# EAGLE design MRCS-12v-power-block (EAGLE 7.7.0)
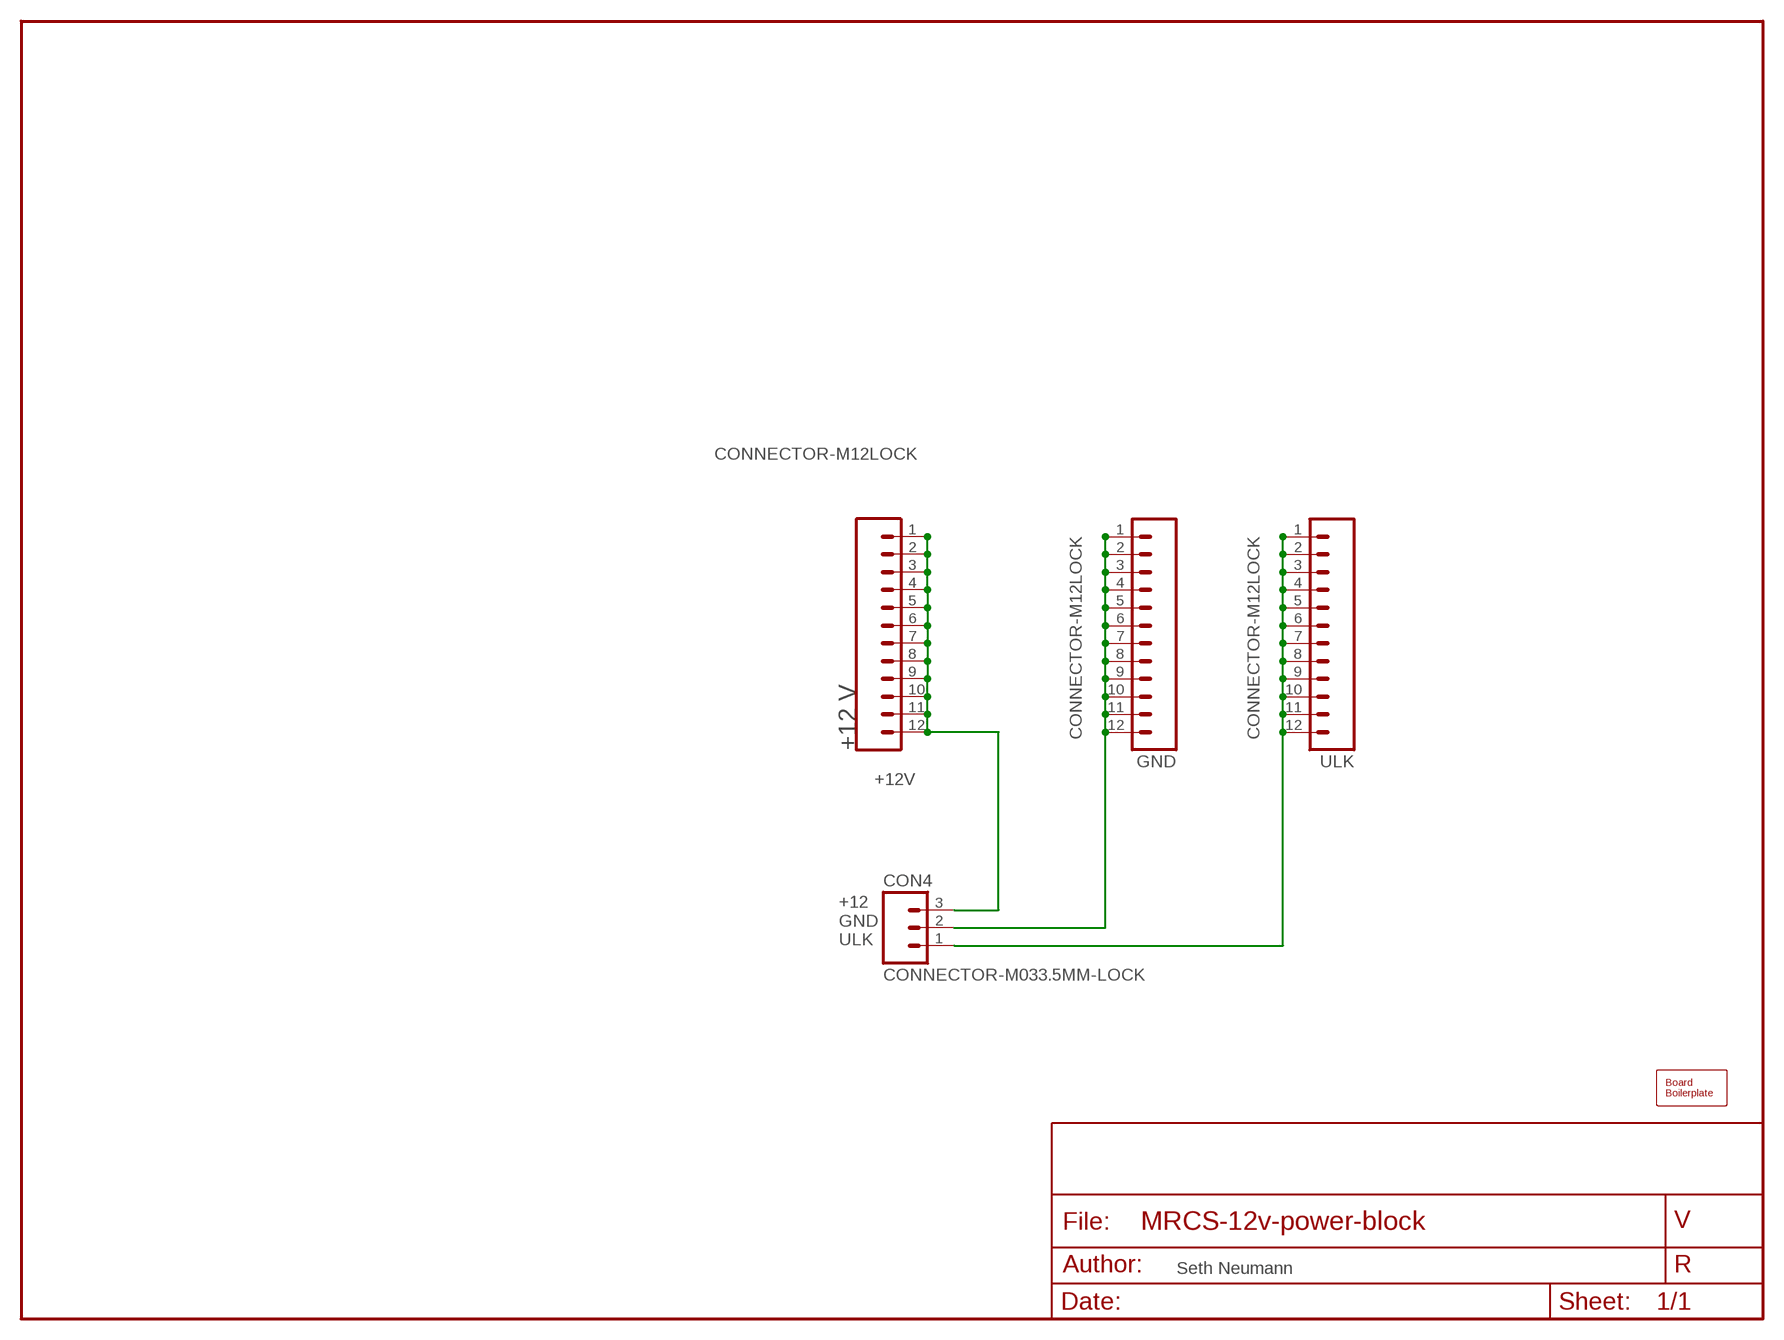
[diagram p0: schematic, sheet 1]

## Parts
+12V  CONNECTOR-M12LOCK  [1X12_LOCK]
BOARD1  BOARD50X50  [BOARD-SEEED5X5]
CON4  CONNECTOR-M033.5MM-LOCK  [SCREWTERMINAL-3.5MM-3_LOCK.007S]
GND  CONNECTOR-M12LOCK  [1X12_LOCK]
ULK  CONNECTOR-M12LOCK  [1X12_LOCK]

## Nets
N$2 [Power]: CON4.2 GND.1 GND.2 GND.3 GND.4 GND.5 GND.6 GND.7 GND.8 GND.9 GND.10 GND.11 GND.12
N$3 [Power]: CON4.1 ULK.1 ULK.2 ULK.3 ULK.4 ULK.5 ULK.6 ULK.7 ULK.8 ULK.9 ULK.10 ULK.11 ULK.12
N$4 [Power]: +12V.1 +12V.2 +12V.3 +12V.4 +12V.5 +12V.6 +12V.7 +12V.8 +12V.9 +12V.10 +12V.11 +12V.12 CON4.3

## Notes on the sheet
- +12 V
- +12
  GND
  ULK
- Seth Neumann

## Library data of the parts
+12V GND ULK = SPCoast:CONNECTOR-M12: Header 12 Standard 12-pin 0.1" header. Use with straight break away headers (SKU : PRT-00116), right angle break away headers (PRT-00553), swiss pins (PRT-00743), machine pins (PRT-00117), and female headers (PRT-00115).
BOARD1 = SPCoast:BOARD
CON4 = SPCoast:CONNECTOR-M03

## Net classes
0 default: width 0.305 mm, drill 0.127 mm, clearance 0.254 mm
1 Power: width 0.61 mm, drill 0.127 mm, clearance 0.254 mm
2 Phone: width 0.406 mm, drill 0.127 mm, clearance 0.381 mm
3 Nasty Loads: width 0.61 mm, drill 0.127 mm, clearance 0.61 mm

## Board
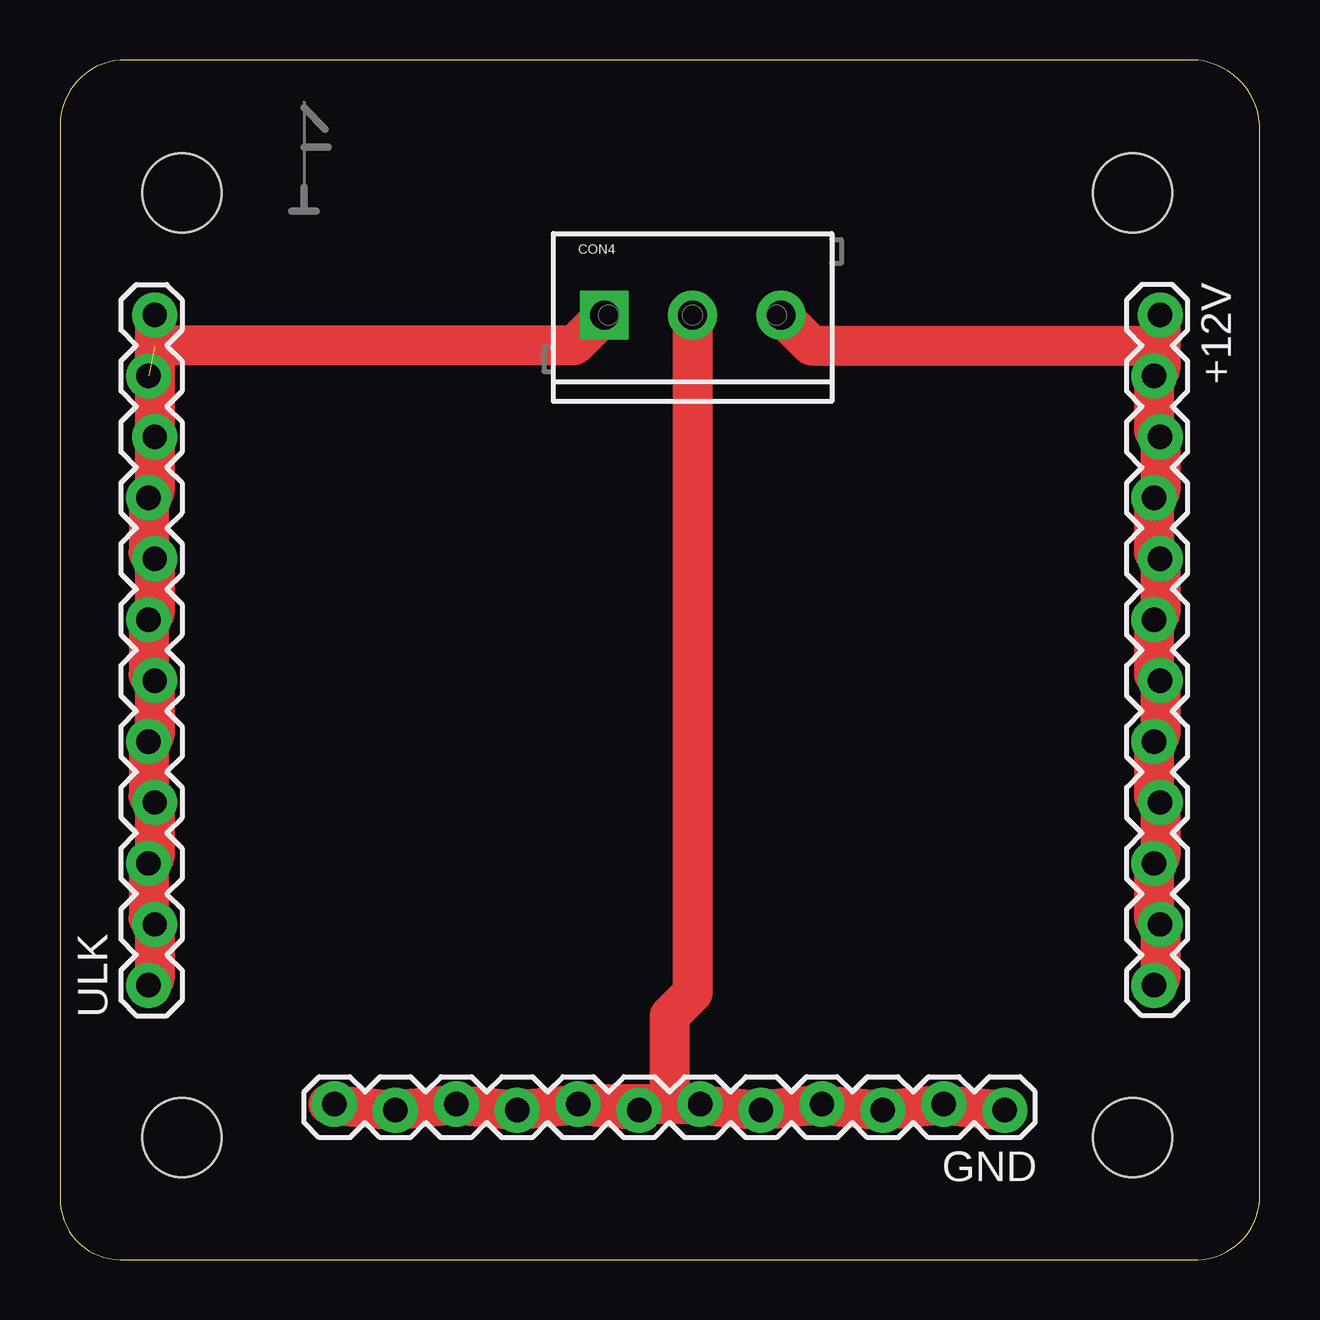
[diagram p1: board, top side]

Size 50.01 x 50 mm. Coordinates in mm from the lower left corner, seen from the top.
Copper layers (1*16): Top 0.035mm / dielectric 1.5mm / Bottom 0.035mm
Design rules "default": minimum track width 10mil, minimum drill 0.6mm, track to track 8mil, track to pad 8mil, pad to pad 8mil, via to via 8mil, smd to smd 8mil, copper to edge 40mil, drill to drill 8mil, minimum pad ring 10mil, minimum via ring 8mil, stop-mask expansion 4mil, vias tented up to drill 0mil, thermal gap 10mil

### Footprints (pad centres in the part's own frame; a part is rotated, then mirrored left to right if it is on the bottom)
1X12_LOCK = drill 1.016 pad 1.88: 1 0,0.127; 2 2.54,-0.127; 3 5.08,0.127; 4 7.62,-0.127; 5 10.16,0.127; 6 12.7,-0.127; 7 15.24,0.127; 8 17.78,-0.127; 9 20.32,0.127; 10 22.86,-0.127; 11 25.4,0.127; 12 27.94,-0.127
BOARD-SEEED5X5 = hole 3.3: 44.704,5.08; 5.08,44.45; 44.704,44.45; 5.08,5.08
SCREWTERMINAL-3.5MM-3_LOCK.007S = drill 1.2 pad 2.032 square: 1 -0.178,0 | drill 1.2 pad 2.032: 2 3.5,0; 3 7.178,0

### Placement (x,y rotation side)
+12V  45.73,39.37 270 top
BOARD1  0.01,0 0 top
CON4  22.87,39.37 0 top
GND  39.38,6.35 180 top
U$1  [CA-PROP65-BACK]  36.84,20.32 0 top
U$2  [MRCSLOGOTOP]  8.9,43.18 0 top
U$3  [MRCSLOGOBTM]  8.9,43.18 0 top
ULK  3.82,11.43 90 top

### Tracks (layer width: path | path; a pad name or v marks a point on that pad's centre or on a via)
N$2
  Top 1.676: GND.12 11.19,6.48 GND.11 13.73,6.23 GND.10 16.27,6.48 17.85,6.34 GND.9 18.81,6.23 GND.8 21.35,6.48 GND.7 21.85,6.48 25.41,6.48 | 25.41,6.48 GND.6 26.43,6.48 GND.5 28.97,6.23 GND.4 31.51,6.48 GND.3 34.05,6.23 GND.2 36.59,6.48 GND.1 | CON4.2 26.37,11.12 25.41,10.16 25.41,6.48
N$3  (1 unrouted)
  Top 1.676: ULK.12 3.95,38.1 | 3.95,38.1 ULK.10 3.95,32.01 ULK.9 3.69,29.47 ULK.8 3.95,26.93 ULK.7 3.69,24.39 ULK.6 3.95,21.85 ULK.5 3.69,19.31 ULK.4 3.95,16.77 ULK.3 3.69,14.23 ULK.2 3.95,11.69 ULK.1 | CON4.1 21.42,38.1 3.95,38.1
N$4
  Top 1.676: +12V.1 45.86,38.1 | 45.86,38.1 45.86,37.09 +12V.2 45.6,34.55 +12V.3 45.86,32.01 +12V.4 45.6,29.47 +12V.5 45.86,26.93 +12V.6 45.6,24.39 +12V.7 45.86,21.85 +12V.8 45.6,19.31 +12V.9 45.86,16.77 +12V.10 45.6,14.23 +12V.11 45.86,11.69 +12V.12 | CON4.3 31.32,38.1 45.86,38.1

### Text on the board
tDocu: ULK / GND / +12 | Power, Unlock & / Ground Distribution | UnLock | 12V | GND
_tNames: CON4 | CON4 | +12V | +12V | ULK | ULK | GND | GND